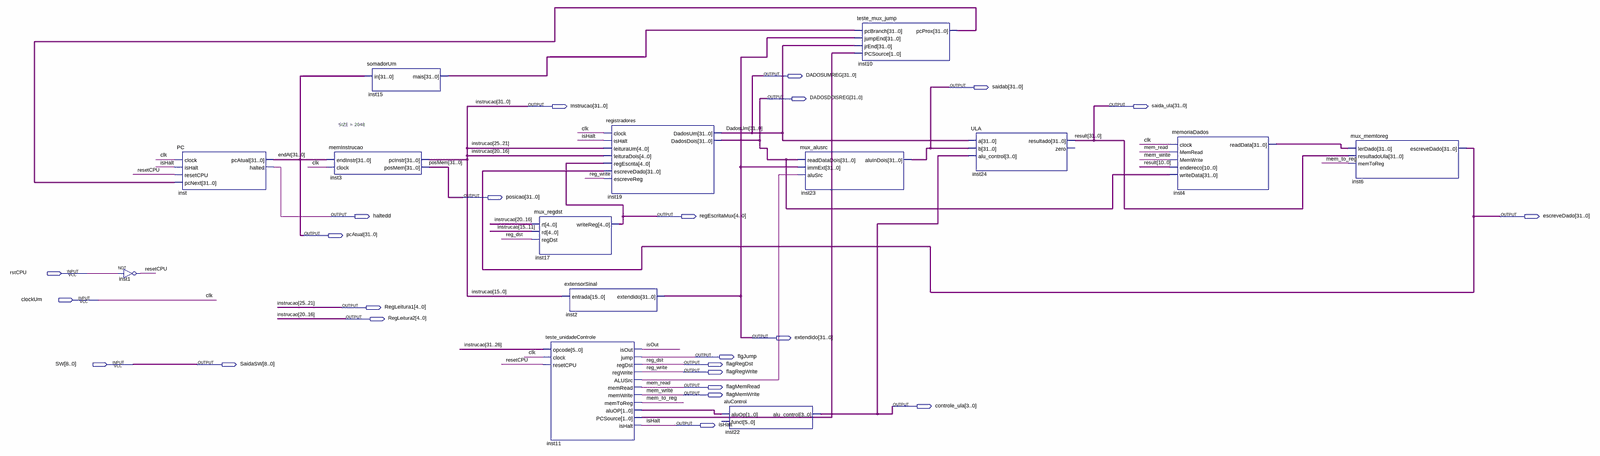
[diagram p0: schematic sheet, whole]
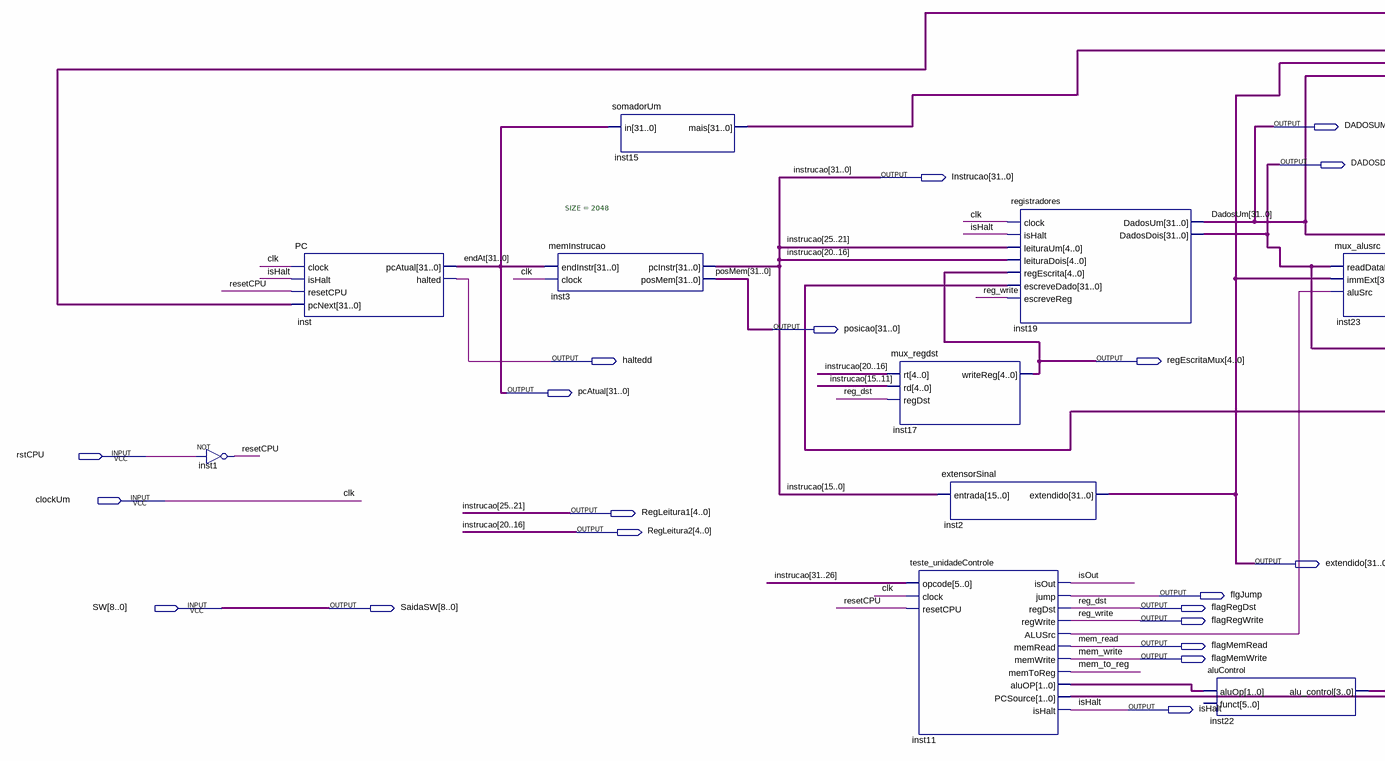
[diagram p1: schematic sheet, left part]
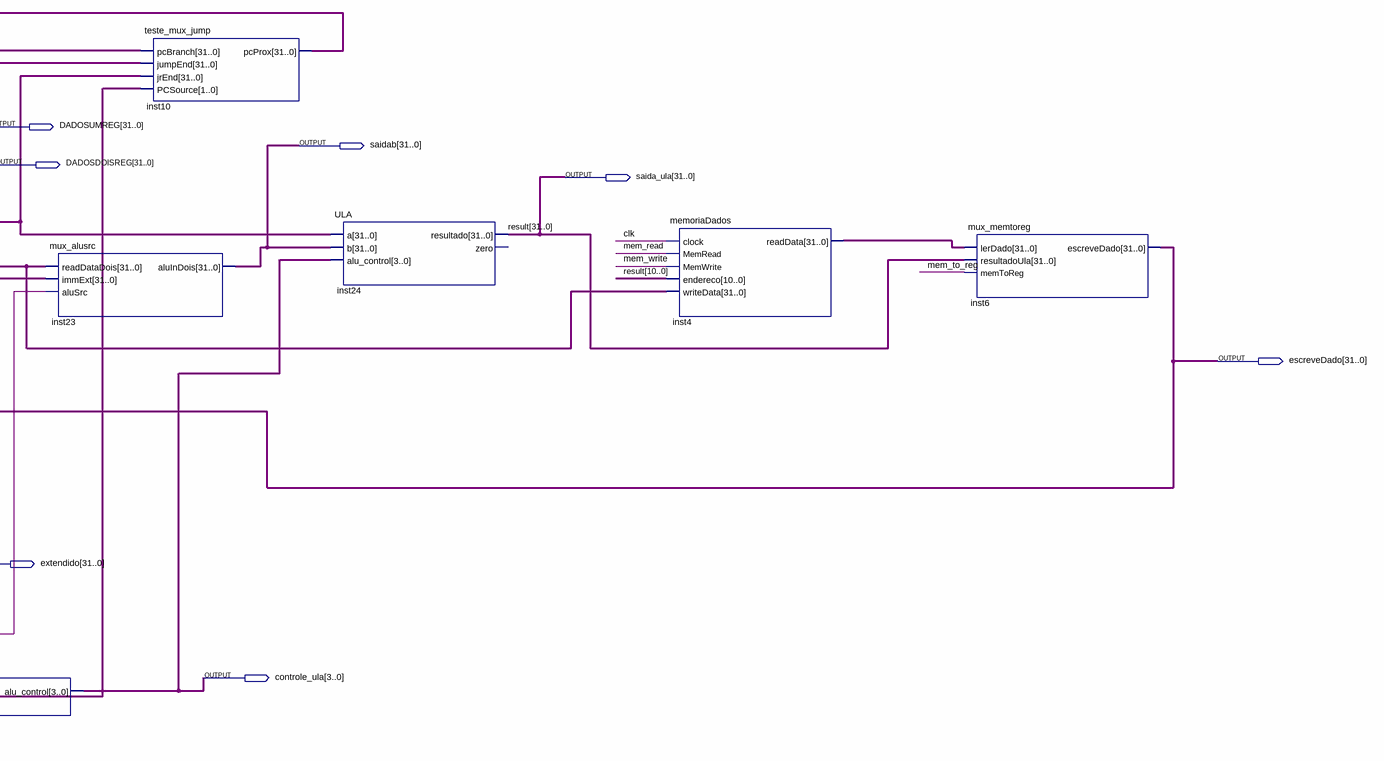
[diagram p2: schematic sheet, right part]
// Quartus schematic testeSemTemporizador.bdf as structural Verilog: 14 symbols, 24 pins
module testeSemTemporizador (
  input  rstCPU,
  input  clockUm,
  input  [8:0] SW,
  output [31:0] DADOSUMREG,
  output [31:0] saidab,
  output [31:0] DADOSDOISREG,
  output [31:0] Instrucao,
  output [31:0] saida_ula,
  output [31:0] posicao,
  output haltedd,
  output [4:0] regEscritaMux,
  output [31:0] escreveDado,
  output [31:0] pcAtual,
  output [4:0] RegLeitura1,
  output [4:0] RegLeitura2,
  output [31:0] extendido,
  output flgJump,
  output [8:0] SaidaSW,
  output flagRegDst,
  output flagRegWrite,
  output flagMemRead,
  output flagMemWrite,
  output [3:0] controle_ula,
  output isHalt
);

  wire inst11_alusrc, isOut, mem_to_reg, resetCPU;
  wire [1:0] inst11_aluop, inst11_pcsource;
  wire [31:0] inst4_readdata, inst10_pcprox, inst15_mais;

  not inst1 (resetCPU, rstCPU);
  PC inst (
    .clock(clockUm), .isHalt(isHalt), .resetCPU(resetCPU), .pcNext(inst10_pcprox), .pcAtual(pcAtual),
    .halted(haltedd));
  memInstrucao #(.SIZE(2048)) inst3 (.endInstr(pcAtual), .clock(clockUm), .pcInstr(Instrucao), .posMem(posicao));
  somadorUm inst15 (.in(pcAtual), .mais(inst15_mais));
  mux_regdst inst17 (.rt(Instrucao[20:16]), .rd(Instrucao[15:11]), .regDst(flagRegDst), .writeReg(regEscritaMux));
  teste_unidadeControle inst11 (
    .opcode(Instrucao[31:26]), .clock(clockUm), .resetCPU(resetCPU), .isOut(isOut), .jump(flgJump),
    .regDst(flagRegDst), .regWrite(flagRegWrite), .ALUSrc(inst11_alusrc), .memRead(flagMemRead),
    .memWrite(flagMemWrite), .memToReg(mem_to_reg), .aluOP(inst11_aluop), .PCSource(inst11_pcsource),
    .isHalt(isHalt));
  extensorSinal inst2 (.entrada(Instrucao[15:0]), .extendido(extendido));
  registradores inst19 (
    .clock(clockUm), .isHalt(isHalt), .leituraUm(Instrucao[25:21]), .leituraDois(Instrucao[20:16]),
    .regEscrita(regEscritaMux), .escreveDado(escreveDado), .escreveReg(flagRegWrite), .DadosUm(DADOSUMREG),
    .DadosDois(DADOSDOISREG));
  aluControl inst22 (.aluOp(inst11_aluop), .alu_control(controle_ula));  // open: funct
  mux_alusrc inst23 (.readDataDois(DADOSDOISREG), .immExt(extendido), .aluSrc(inst11_alusrc), .aluInDois(saidab));
  teste_mux_jump inst10 (
    .pcBranch(inst15_mais), .jumpEnd(extendido), .jrEnd(DADOSUMREG), .PCSource(inst11_pcsource),
    .pcProx(inst10_pcprox));
  ULA inst24 (.a(DADOSUMREG), .b(saidab), .alu_control(controle_ula), .resultado(saida_ula));  // open: zero
  memoriaDados inst4 (
    .clock(clockUm), .MemRead(flagMemRead), .MemWrite(flagMemWrite), .endereco(saida_ula[10:0]),
    .writeData(DADOSDOISREG), .readData(inst4_readdata));
  mux_memtoreg inst6 (
    .lerDado(inst4_readdata), .resultadoUla(saida_ula), .memToReg(mem_to_reg), .escreveDado(escreveDado));

  assign RegLeitura1 = Instrucao[25:21];
  assign RegLeitura2 = Instrucao[20:16];
  assign SaidaSW = SW;

  // Other names for the same wires on the sheet: clk = clockUm; DadosUm[31:0] = DADOSUMREG; endAt[31:0] = pcAtual;
  //   mem_read = flagMemRead; mem_write = flagMemWrite; posMem[31:0] = posicao; reg_dst = flagRegDst;
  //   reg_write = flagRegWrite; result[31:0] = saida_ula
endmodule
